# Altium schematic sheet simCard.SchDoc
size A4
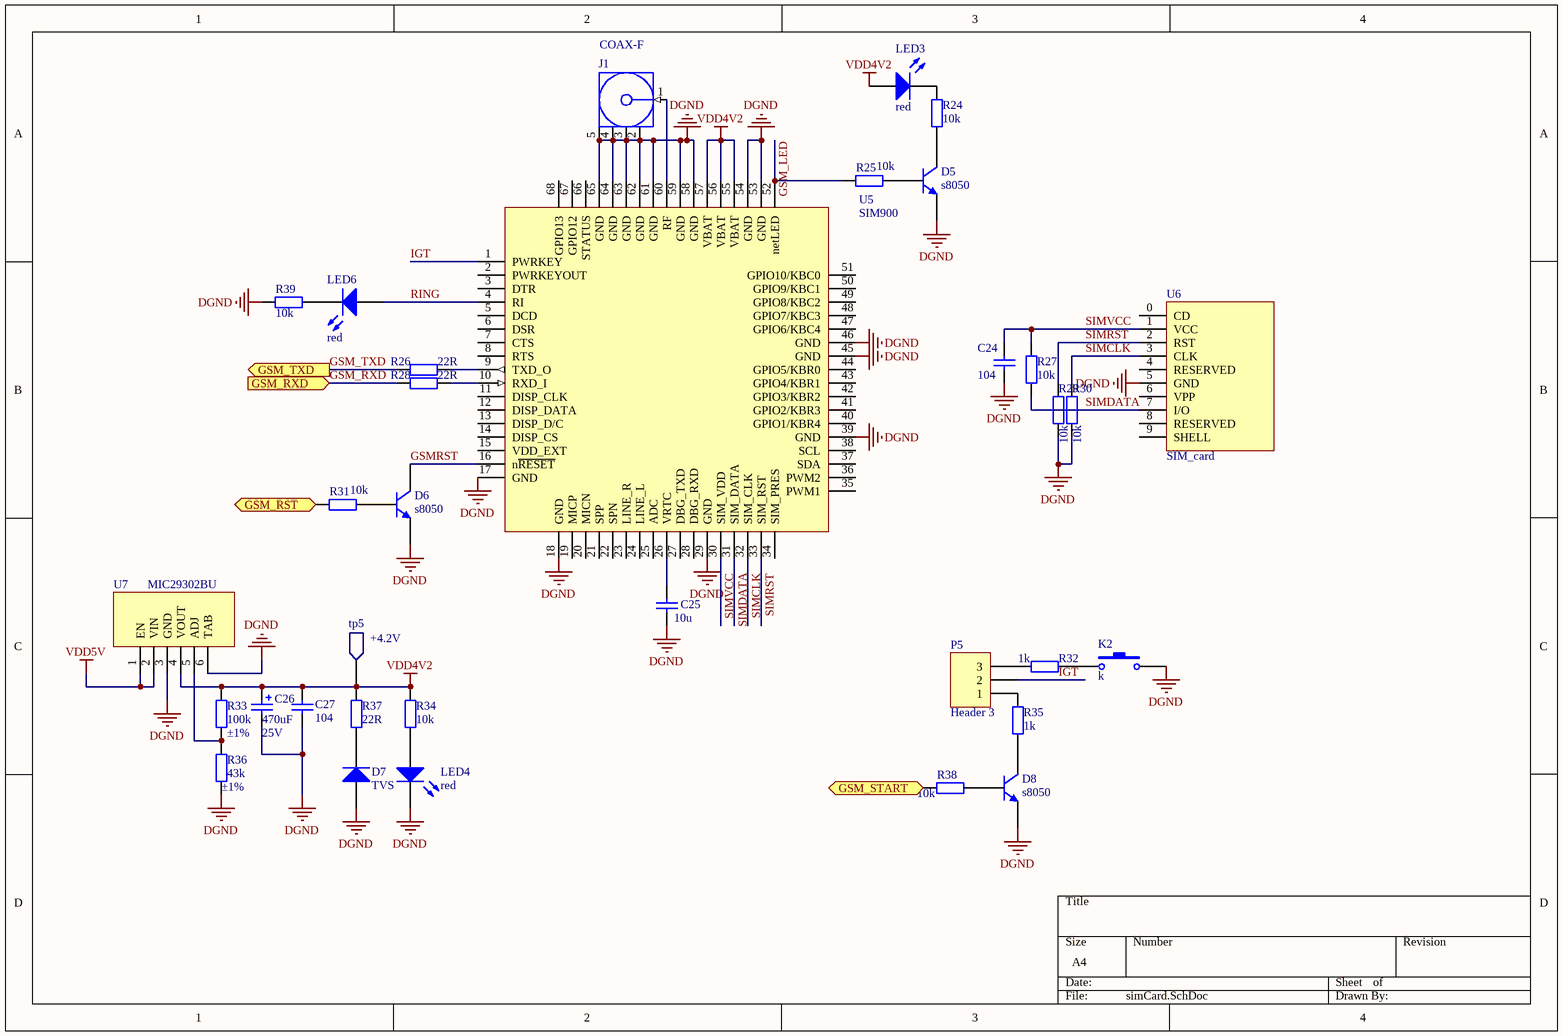
[diagram p0: simCard.SchDoc]

## Parts
C24  104  [0603_]
C25  10u  [0603_]
C26  470uF  VDC_: 25V  [Cap - 10mmx10mm]
C27  104  [0603_]
D5  s8050  [SOT-23(bce)]
D6  s8050  [SOT-23(bce)]
D7  TVS  [SMB]
D8  s8050  [SOT-23(bce)]
J1  COAX-F  [MCX5.08-H5]
K2  k  [key-2pin]
LED3  red  [0603_diode]
LED4  red  [0603_diode]
LED6  red  [0603_diode]
P5  Header 3  [HDR1X3]
R24  10k  [0603_]
R25  10k  [0603_]
R26  22R  [0603_]
R27  10k  [0603_]
R28  22R  [0603_]
R29  10k  [0603_]
R30  10k  [0603_]
R31  10k  [0603_]
R32  1k  [0603_]
R33  100k  Tolerance_: ±1%  [0603_]
R34  10k  [0603_]
R35  1k  [0603_]
R36  43k  Tolerance_: ±1%  [0603_]
R37  22R  [0603_]
R38  10k  [0603_]
R39  10k  [0603_]
tp5  +4.2V  [testPoint]
U5  SIM900  [SIM900]
U6  SIM_card  [SIM_Card]
U7  MIC29302BU  [TO-263(S)]

## Ports
GSM_RST (in), GSM_RXD (in), GSM_START (in), GSM_TXD (out)

## Nets
DGND: C24.1 C25.1 C26.2 C27.1 D5.e(E) D6.e(E) D7.A D8.e(E) J1.2(GND) J1.3(GND) J1.4(GND) J1.5(GND) K2.2 LED4.2(K) R29.1 R30.1 R36.1 R39.1 U5.17(GND) U5.18(GND) U5.29(GND) U5.39(GND) U5.45(GND) U5.46(GND) U5.53(GND) U5.54(GND) U5.58(GND) U5.59(GND) U5.61(GND) U5.62(GND) U5.63(GND) U5.64(GND) U5.65(GND) U6.5(GND) U7.3(GND) U7.6(TAB)
VDD4V2: C26.1 C27.2 LED3.1(A) R33.2 R34.2 R37.2 tp5.1 U5.55(VBAT) U5.56(VBAT) U5.57(VBAT) U7.4(VOUT)
VDD5V: U7.1(EN) U7.2(VIN)
GSM_LED: R25.2 U5.52(netLED)
GSM_RST: R31.2 ; port GSM_RST
GSM_RXD: R28.1 ; port GSM_RXD
GSM_START: R38.2 ; port GSM_START
GSM_TXD: R26.1 ; port GSM_TXD
GSMRST: D6.c(C) U5.16(n~{RESET})
IGT: P5.2 U5.1(PWRKEY)
RING: LED6.1(A) U5.4(RI)
SIMCLK: R30.2 U5.32(SIM_CLK) U6.3(CLK)
SIMDATA: R27.1 U5.31(SIM_DATA) U6.7(I/O)
SIMRST: R29.2 U5.33(SIM_RST) U6.2(RST)
SIMVCC: C24.2 R27.2 U5.30(SIM_VDD) U6.1(VCC)
NetC25_2: C25.2 U5.26(VRTC)
NetD5_b: D5.b(B) R25.1
NetD5_c: D5.c(C) R24.1
NetD6_b: D6.b(B) R31.1
NetD7_K: D7.K R37.1
NetD8_b: D8.b(B) R38.1
NetD8_c: D8.c(C) R35.1
NetJ1_1: J1.1(Signal) U5.60(RF)
NetK2_1: K2.1 R32.1
NetLED3_2: LED3.2(K) R24.2
NetLED4_1: LED4.1(A) R34.1
NetLED6_2: LED6.2(K) R39.2
NetP5_1: P5.1 R35.2
NetP5_3: P5.3 R32.2
NetR26_2: R26.2 U5.9(TXD_O)
NetR28_2: R28.2 U5.10(RXD_I)
NetR33_1: R33.1 R36.2 U7.5(ADJ)

Not connected (* = marked no-connect by the designer): U5 2(PWRKEYOUT) 3(DTR) 5(DCD) 6(DSR) 7(CTS) 8(RTS) 11(DISP_CLK) 12(DISP_DATA) 13(DISP_D/C) 14(DISP_CS) 15(VDD_EXT) 19(MICP) 20(MICN) 21(SPP) 22(SPN) 23(LINE_R) 24(LINE_L) 25(ADC) 27(DBG_TXD) 28(DBG_RXD) 34(SIM_PRES) 35(PWM1) 36(PWM2) 37(SDA) 38(SCL) 40(GPIO1/KBR4) 41(GPIO2/KBR3) 42(GPIO3/KBR2) 43(GPIO4/KBR1) 44(GPIO5/KBR0) 47(GPIO6/KBC4) 48(GPIO7/KBC3) 49(GPIO8/KBC2) 50(GPIO9/KBC1) 51(GPIO10/KBC0) 66(STATUS) 67(GPIO12) 68(GPIO13); U6 0(CD) 4(RESERVED) 6(VPP) 8(RESERVED) 9(SHELL)

## Library data of the parts
C24 C25 C27 = cap: VDC_: 16V; Tolerance_: ±10%
C26 = cap-pol: Tolerance_: ±10%
D5 D6 D8 = NPN
D7 = diode
J1 = COAX-F: RF Coaxial PCB Connector, MCX; Thru-Hole, Right-Angle Mount Socket, Blunt Post Terminal, 50 Ohm Impedance; PCB_Layout: Complies with manufacturer's recommendation.; DrillSize: Corresponds to nominal value.; Published: 15-Jul-2004; LatestRevisionDate: 15-Jul-2004; LatestRevisionNote: Component Replaced.; DatasheetDocument: 30-May-2003; PackageDocument: 04-Jul-1999; PackageReference: 919-119J-51AX; Publisher: Altium Limited; ComponentLink1Description: Manufacturer Link; ComponentLink1URL: http://www.amphenolrf.com/
K2 = SW
LED3 LED4 LED6 = led
P5 = Header 3: Header, 3-Pin; LatestRevisionDate: 17-Jul-2002; LatestRevisionNote: Re-released for DXP Platform.; Publisher: Altium Limited
R24-R32 R34 R35 R37-R39 = res: Tolerance_: ±5%; Power_: ?W
R33 R36 = res: Power_: ?W
tp5 = pad